# Altium schematic sheet SH3 - LEVEL SHIFTER.SchDoc: LEVEL SHIFTER
size 431 x 279 mm; Engineer: Taylor McNabb; Revision: 2; SheetNumber: 3; SheetTotal: 3
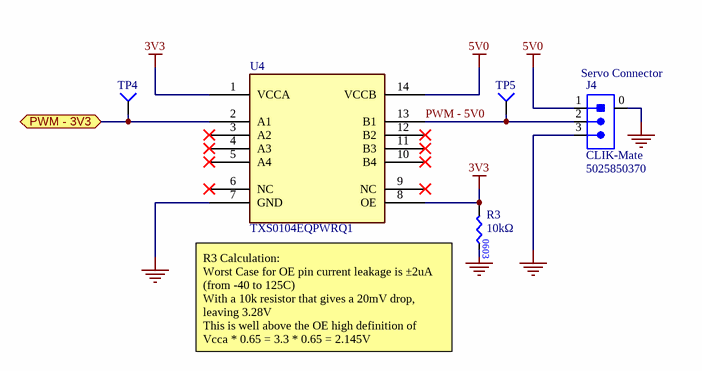
[diagram p0: SH3 - LEVEL SHIFTER.SchDoc]

## Parts
J4  Family: CLIK-Mate  Manufacturer Part Number 1: 5025850370  [MOLEX-5025850370]  (hidden comment: CON_3M_SM_RA)
R3  value 10kΩ  [RES0603]  (hidden comment: RES_10kΩ_0603_5%)
TP4  TESTPOINT_SMD_LOOP  [S1751-46R]  (value not drawn)
TP5  TESTPOINT_SMD_LOOP  [S1751-46R]  (value not drawn)
U4  IC_LVL_SHIFTER_4_CH  [TXS0104EQPWRQ1]  (value not drawn)

## Ports
PWM - 3V3 (bidir)

## Nets
3V3: R3.1 U4.1(VCCA) U4.8(OE)
5V0: J4.1 U4.14(VCCB)
GND: J4.0 J4.3 R3.2 U4.7(GND)
PWM - 3V3: TP4.1(=value) U4.2(A1) ; port PWM - 3V3
PWM - 5V0: J4.2 TP5.1(=value) U4.13(B1)

Not connected (* = marked no-connect by the designer): U4 3(A2)* 4(A3)* 5(A4)* 6(NC)* 9(NC)* 10(B4)* 11(B3)* 12(B2)*

## Notes on the sheet
- (near J4) Servo Connector
- R3 Calculation:
  Worst Case for OE pin current leakage is ±2uA (from -40 to 125C)
  With a 10k resistor that gives a 20mV drop, leaving 3.28V
  This is well above the OE high definition of
  Vcca * 0.65 = 3.3 * 0.65 = 2.145V
- University of Waterloo Robotics Team
- 200 University Ave W
- REV
- PROJECT
- Waterloo, Ontario, Canada
- N2L 3G1
- DOCUMENT
- ENGINEER
- REVIEWER
- MODIFIED
- SHEET
- OF

## Library data of the parts
J4 = CON_3M_SM_RA: CONN RCPT 3POS 0.059 TIN SMD R/A; Manufacturer 1: Molex; Current Rating: 2A; Voltage Rating: 100V; Pitch: 1.5mm; Supplier 1: Digi-Key; Mounting Type: SMD; Package/Footprint: SMD; Orientation: Right Angle; Supplier Part Number 1: WM12831CT-ND
R3 = RES_10kΩ_0603_5%: RES 10K OHM 5% 1/10W 0603; Manufacturer 1: Yageo; Manufacturer Part Number 1: RC0603JR-0710KL; Supplier Part Number 1: 311-10KGRCT-ND; Supplier 1: Digi-Key; Mounting Type: SMD; Package: 0603
TP4 TP5 = TESTPOINT_SMD_LOOP: PC TEST POINT SMD; Manufacturer 1: Harwin; Supplier 1: Digi-Key; Manufacturer Part Number 1: S1751-46R; Supplier Part Number 1: 952-1478-1-ND; Mounting Type: SMD; Package/Footprint: SMD
U4 = IC_LVL_SHIFTER_4_CH: IC BIDIRECTIONAL LEVEL SHIFTER 4 CHANNEL 14TSSOP; Manufacturer 1: Texas Instruments; Data Rate: 24Mbps; Package/Footprint: 14-TSSOP; VCCA Voltage: 1.65 V ~ 3.6 V; VCCB Voltage: 2.3 V ~ 5.5 V; VCCA Max: 3V6 MAX; VCCB Max: 5V5 MAX; Supplier 1: Digi-Key; Mounting Type: SMD; Supplier Part Number 1: 296-41034-1-ND; Manufacturer Part Number 1: TXS0104EQPWRQ1